# Altium schematic sheet SatelliteDevBoard-AndersonsPC.SchDoc: SatelliteDevBoard
size 273 x 204 mm; Origin: Eagle; OriginPath: C:\Users\jacob\OneDrive - Georgia Institute of Technology\Documents\iridium-satellite-comm\SatelliteDevBoard.sch; OriginSheet: 1; Date: 10/23/2025 6:23:18 PM; SheetNumber: 1; GateName_1: G$1; SymbolName_1: LETTER_L; LibraryName: frames; DeviceSetName: LETTER_L; GateName_2: G$2; SymbolName_2: DOCFIELD; Sheet: Sheet:; REV: REV:
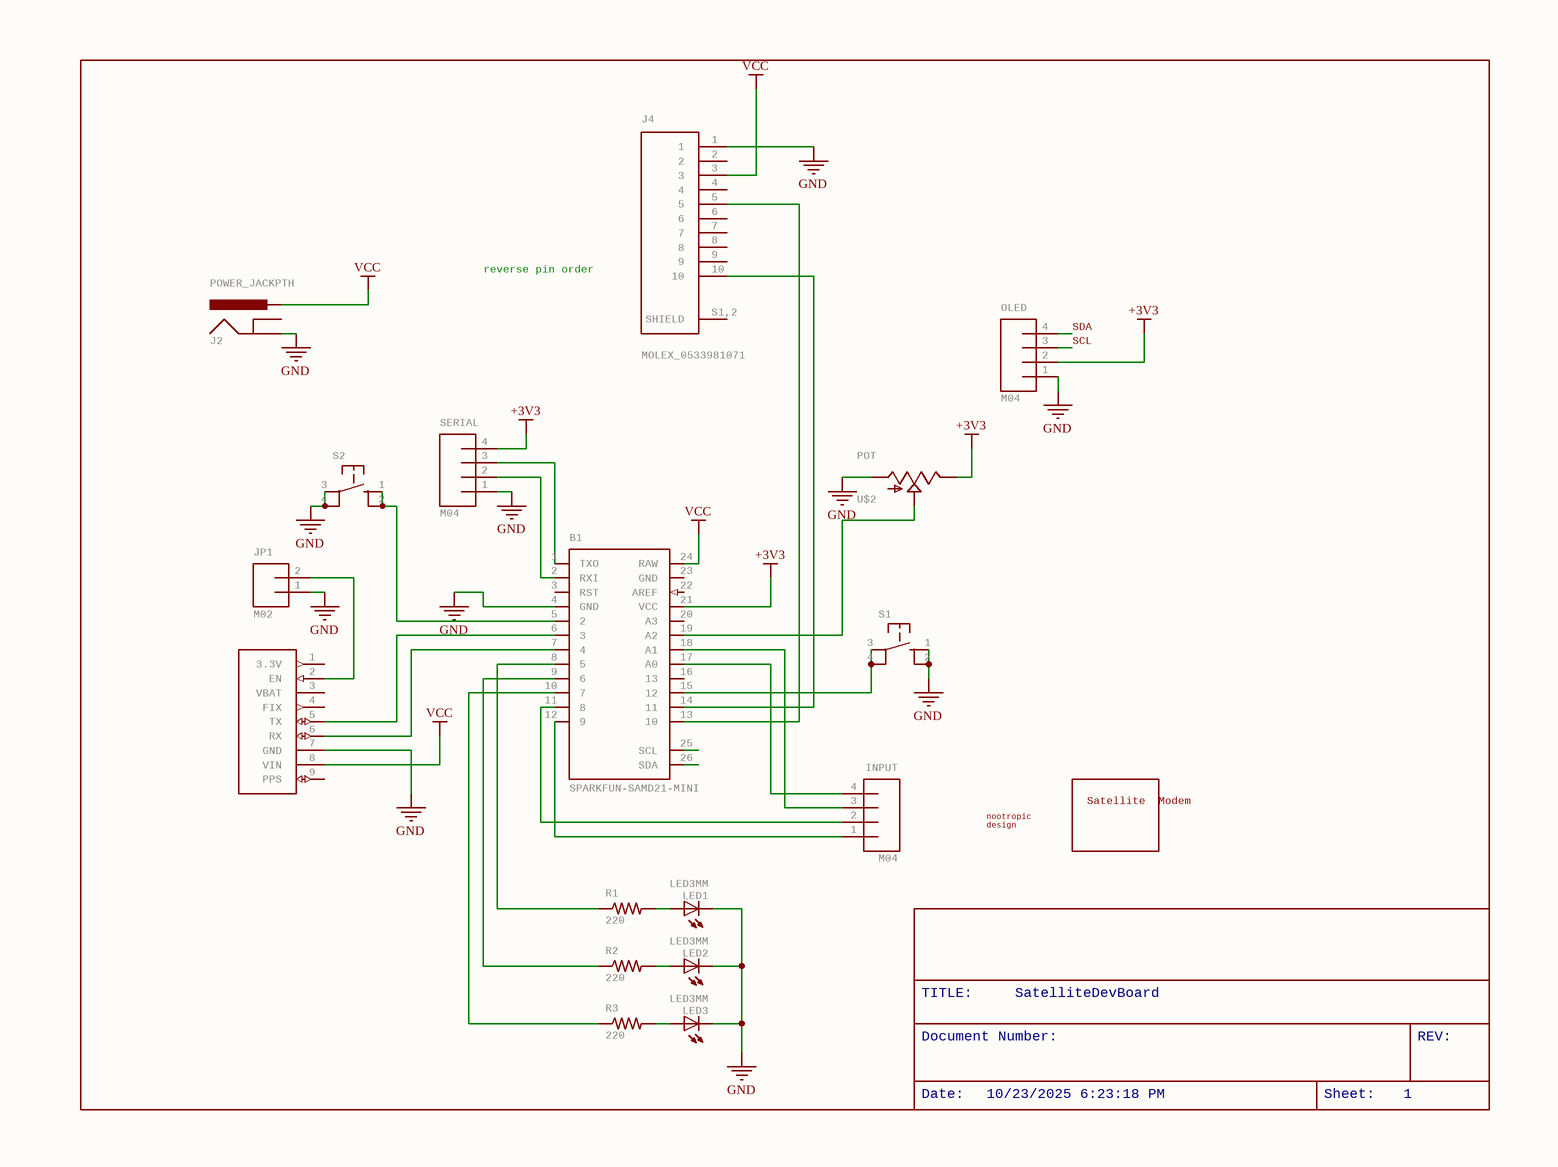
[diagram p0: SatelliteDevBoard-AndersonsPC.SchDoc]

## Parts
B1  SPARKFUN-SAMD21-MINI  [SPARKFUN-SAMD21-MINI]
INPUT  M04  [1X04]
J2  POWER_JACKPTH  [POWER_JACK_PTH]
J4  MOLEX_0533981071  [MOLEX_0533981071]
JP1  M02  [1X02]
LED1  LED3MM  [LED3MM]
LED2  LED3MM  [LED3MM]
LED3  LED3MM  [LED3MM]
OLED  M04  [1X04]
R1  220  [0207/10]
R2  220  [0207/10]
R3  220  [0207/10]
S1  SWITCH-TACT  [SWITCH-TACT]  (value not drawn)
S2  SWITCH-TACT  [SWITCH-TACT]  (value not drawn)
SERIAL  M04  [1X04]
U$1  Satellite
Modem: Satellite / Modem  [ROCKBLOCK-9603]  (hidden comment: ROCKBLOCK-9603)
U$2  POT  [TRIMMERPOT]
U$3  ADAFRUIT-ULTIMATE-GPS-MODULE  [ADAFRUIT-ULTIMATE-GPS]  (value not drawn)
U$4  LOGO  [LOGO_SMALL]  (value not drawn)

## Nets
+3V3: B1.21(VCC) OLED.2 SERIAL.4 U$2.3
GND: B1.4(GND) J2.GND J4.1 JP1.1 LED1.K(C) LED2.K(C) LED3.K(C) OLED.1 S1.1(S) S1.2(S1) S2.3(P) S2.4(P1) SERIAL.1 U$2.1 U$3.7(GND)
VCC: B1.24(RAW) J2.PWR J4.3 U$3.8(VIN)
SCL: OLED.3
SDA: OLED.4
NetB1_1: B1.1(TXO) SERIAL.3
NetB1_2: B1.2(RXI) SERIAL.2
NetB1_5: B1.5(2) S2.1(S) S2.2(S1)
NetB1_6: B1.6(3) U$3.5(TX)
NetB1_7: B1.7(4) U$3.6(RX)
NetB1_8: B1.8(5) R1.1
NetB1_9: B1.9(6) R2.1
NetB1_10: B1.10(7) R3.1
NetB1_11: B1.11(8) INPUT.2
NetB1_12: B1.12(9) INPUT.1
NetB1_13: B1.13(10) J4.5
NetB1_14: B1.14(11) J4.10
NetB1_15: B1.15(12) S1.3(P) S1.4(P1)
NetB1_17: B1.17(A0) INPUT.4
NetB1_18: B1.18(A1) INPUT.3
NetB1_19: B1.19(A2) U$2.2(WIPER) U$2.4(WIPER)
NetJP1_2: JP1.2 U$3.2(EN)
NetLED1_A: LED1.A R1.2
NetLED2_A: LED2.A R2.2
NetLED3_A: LED3.A R3.2

Not connected (* = marked no-connect by the designer): B1 3(RST) 16(13) 20(A3) 22(AREF) 23(GND) 25(SCL) 26(SDA); J2 GNDBREAK; J4 2 4 6 7 8 9 S1,2(SHIELD); U$3 1(3.3V) 3(VBAT) 4(FIX) 9(PPS)

## Notes on the sheet
- reverse pin order
- TITLE:
- Document Number:
- SatelliteDevBoard
- REV:
- Date:
- 10/23/2025 6:23:18 PM
- Sheet:
- 1

## Library data of the parts
B1 = SPARKFUN-SAMD21-MINI: SparkFun Pro Mini     Pro Mini compatible footprint.    Dimensions: 0.7 x 1.3"  PCB Thickness: 0.8mm    SparkFun Products: 3.3V/8MHz  5V/16MHz; GateName_1: G$1; SymbolName_1: SPARKFUN-SAMD-MINI; LibraryName: nootropicdesign; DeviceSetName: SPARKFUN-SAMD21-MINI
INPUT OLED SERIAL = M04: 4-pin header; GateName_1: G$1; SymbolName_1: M04; LibraryName: nootropicdesign; DeviceSetName: M04
J2 = POWER_JACKPTH: Power JackThis is the standard 5.5mm barrel jack for power. The PTH is the most common, proven, reliable, footprint. The Slot footprint only works if the mill layer is transmitted to the PCB fab house so be warned. Spark Fun Electronics SKU : PRT-00119 SMT: CONN-08106 Mating wall wart : TOL-00298 (and others); GateName_1: G$1; SymbolName_1: POWERJACK; DeviceName: PTH; LibraryName: nootropicdesign; DeviceSetName: POWER_JACK
J4 = MOLEX_0533981071: CONN HEADER 10POS 1.25MM VERT SMD; GateName_1: G$1; SymbolName_1: MOLEX_0533981071; LibraryName: nootropicdesign; DeviceSetName: MOLEX_0533981071
JP1 = M02: 2-pin header; GateName_1: G$1; SymbolName_1: M02; LibraryName: nootropicdesign; DeviceSetName: M02
LED1-LED3 = LED3MM: LED   OSRAM: - CHIPLED LG R971, LG N971, LY N971, LG Q971, LY Q971, LO R971, LY R971 LH N974, LH R974 LS Q976, LO Q976, LY Q976 LO Q996 - Hyper CHIPLED LW Q18S LB Q993, LB Q99A, LB R99A - SideLED LS A670, LO A670, LY A670, LG A670, LP A670 LB A673, LV A673, LT A673, LW A673 LH A674 LY A675 LS A676, LA A676, LO A676, LY A676, LW A676 LS A679, LY A679, LG A679 -  Hyper Micro SIDELEDÂ® LS Y876, LA Y876, LO Y876, LY Y876 LT Y87S - SmartLED LW L88C, LW L88S LB L89C, LB L89S, LG L890 LS L89K, LO L89K, LY L89K LS L896, LA L896, LO L896, LY L896 - TOPLED LS T670, LO T670, LY T670, LG T670, LP T670 LSG T670, LSP T670, LSY T670, LOP T670, LYG T670 LG T671, LOG T671, LSG T671 LB T673, LV T673, LT T673, LW T673 LH T674 LS T676, LA T676, LO T676, LY T676, LB T676, LH T676, LSB T676, LW T676 LB T67C, LV T67C, LT T67C, LS T67K, LO T67K, LY T67K, LW E67C LS E67B, LA E67B, LO E67B, LY E67B, LB E67C, LV E67C, LT E67C LW T67C LS T679, LY T679, LG T679 LS T770, LO T770, LY T770, LG T770, LP T770 LB T773, LV T773, LT T773, LW T773 LH T774 LS E675, LA E675, LY E675, LS T675 LS T776, LA T776, LO T776, LY T776, LB T776 LHGB T686 LT T68C, LB T68C - Hyper Mini TOPLEDÂ® LB M676 - Mini TOPLED SantanaÂ® LG M470 LS M47K, LO M47K, LY M47K    Source: http://www.osram.convergy.de/; GateName_1: G$1; DeviceName: 3MM; SymbolName_1: LED; LibraryName: nootropicdesign; DeviceSetName: LED
R1-R3 = R-US: Resistor; GateName_1: G$1; SymbolName_1: R-US; LibraryName: nootropicdesign; DeviceSetName: R-US
S1 S2 = SWITCH-TACT: 12MM Tactile Switch; GateName_1: G$1; SymbolName_1: SWITCH-TACT; LibraryName: nootropicdesign; DeviceSetName: SWITCH-TACT
U$1 = ROCKBLOCK-9603: GateName_1: G$1; SymbolName_1: SATMODEM; LibraryName: nootropicdesign; DeviceSetName: ROCKBLOCK-9603
U$2 = POT: GateName_1: G$1; SymbolName_1: POT; LibraryName: nootropicdesign; DeviceSetName: POT
U$3 = ADAFRUIT-ULTIMATE-GPS-MODULE: GateName_1: G$1; SymbolName_1: ADAFRUIT-GPS; LibraryName: nootropicdesign; DeviceSetName: ADAFRUIT-ULTIMATE-GPS-MODULE
U$4 = LOGO: GateName_1: G$1; SymbolName_1: LOGO; LibraryName: nootropicdesign; DeviceSetName: LOGO; nootropic: nootropic; design: design